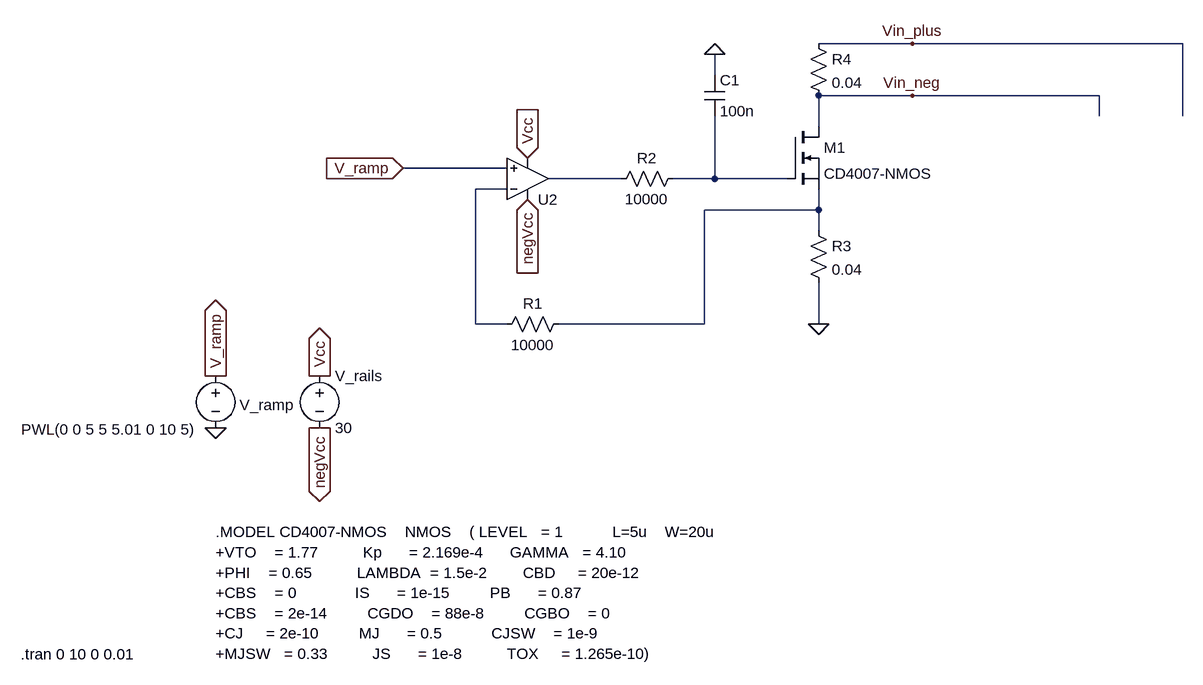
[diagram p0: schematic var_resistor.asc]
var_resistor.asc, the LTspice schematic file:
Version 4
SHEET 1 3064 940
WIRE 2176 -16 2032 -16
WIRE 2592 -16 2176 -16
WIRE 1872 32 1872 0
WIRE 2176 64 2032 64
WIRE 2464 64 2176 64
WIRE 2464 96 2464 64
WIRE 2592 96 2592 -16
WIRE 2032 112 2032 64
WIRE 1552 176 1392 176
WIRE 1728 192 1616 192
WIRE 1872 192 1872 96
WIRE 1872 192 1808 192
WIRE 1984 192 1872 192
WIRE 1552 208 1504 208
WIRE 2032 240 2032 208
WIRE 2032 240 1856 240
WIRE 2032 272 2032 240
WIRE 1504 416 1504 208
WIRE 1552 416 1504 416
WIRE 1856 416 1856 240
WIRE 1856 416 1632 416
WIRE 2032 416 2032 352
FLAG 1584 160 Vcc
IOPIN 1584 160 In
FLAG 1584 224 negVcc
IOPIN 1584 224 In
FLAG 1264 496 Vcc
IOPIN 1264 496 Out
FLAG 1264 576 negVcc
IOPIN 1264 576 Out
FLAG 1872 0 0
FLAG 1392 176 V_ramp
IOPIN 1392 176 In
FLAG 2176 -16 Vin_plus
FLAG 2176 64 Vin_neg
FLAG 2032 416 0
FLAG 1104 576 0
FLAG 1104 496 V_ramp
IOPIN 1104 496 Out
SYMBOL res 1824 176 R90
WINDOW 0 0 56 VBottom 2
WINDOW 3 32 56 VTop 2
SYMATTR InstName R2
SYMATTR Value 10000
SYMBOL nmos 1984 112 R0
SYMATTR InstName M1
SYMATTR Value CD4007-NMOS
SYMBOL voltage 1264 480 R0
WINDOW 123 0 0 Left 0
WINDOW 39 0 0 Left 0
SYMATTR InstName V_rails
SYMATTR Value 30
SYMBOL res 1648 400 R90
WINDOW 0 0 56 VBottom 2
WINDOW 3 32 56 VTop 2
SYMATTR InstName R1
SYMATTR Value 10000
SYMBOL cap 1856 32 R0
SYMATTR InstName C1
SYMATTR Value 100n
SYMBOL voltage 1104 480 R0
WINDOW 0 37 60 Left 2
WINDOW 3 -299 98 Left 2
WINDOW 123 0 0 Left 0
WINDOW 39 0 0 Left 0
SYMATTR InstName V_ramp
SYMATTR Value PWL(0 0 5 5 5.01 0 10 5)
SYMBOL OpAmps\\UniversalOpAmp 1584 192 M180
SYMATTR InstName U2
SYMBOL res 2016 256 R0
SYMATTR InstName R3
SYMATTR Value 0.04
SYMBOL res 2016 -32 R0
SYMATTR InstName R4
SYMATTR Value 0.04
TEXT 1104 736 Left 2 !.MODEL CD4007-NMOS    NMOS    ( LEVEL   = 1           L=5u    W=20u             \n+VTO    = 1.77          Kp      = 2.169e-4      GAMMA   = 4.10  \n+PHI    = 0.65          LAMBDA  = 1.5e-2        CBD     = 20e-12\n+CBS    = 0             IS      = 1e-15         PB      = 0.87\n+CBS    = 2e-14         CGDO    = 88e-8         CGBO    = 0\n+CJ     = 2e-10         MJ      = 0.5           CJSW    = 1e-9\n+MJSW   = 0.33          JS      = 1e-8          TOX     = 1.265e-10)
TEXT 804 924 Left 2 !.tran 0 10 0 0.01

The netlist it stands for:
* var_resistor.asc
R2 N002 N001 10000
M1 Vin_neg N002 N004 N004 CD4007-NMOS
V_rails Vcc negVcc 30
R1 N004 N003 10000
C1 0 N002 100n
V_ramp V_ramp 0 PWL(0 0 5 5 5.01 0 10 5)
XU2 V_ramp N003 negVcc Vcc N001 level1 Avol=1Meg GBW=10Meg Vos=0 En=0 Enk=0 In=0 Ink=0 Rin=500Meg  ; pins In+ In- V+ V- OUT
R3 N004 0 0.04
R4 Vin_plus Vin_neg 0.04
.model NMOS NMOS
.model PMOS PMOS
.lib standard.mos
.MODEL CD4007-NMOS    NMOS    ( LEVEL   = 1           L=5u    W=20u
+VTO    = 1.77          Kp      = 2.169e-4      GAMMA   = 4.10
+PHI    = 0.65          LAMBDA  = 1.5e-2        CBD     = 20e-12
+CBS    = 0             IS      = 1e-15         PB      = 0.87
+CBS    = 2e-14         CGDO    = 88e-8         CGBO    = 0
+CJ     = 2e-10         MJ      = 0.5           CJSW    = 1e-9
+MJSW   = 0.33          JS      = 1e-8          TOX     = 1.265e-10)
.tran 0 10 0 0.01
.lib UniversalOpAmp1.lib
.backanno
.end